# Altium schematic sheet PCB方案验证板  12V5A 60Wascii.SchDoc
size A2; SheetNumber: 1; SheetTotal: 1; PageSetup: Record=PageOptions|CenterHorizontal=True|CenterVertical=True|PrintScale=0.97|XCorrection=1.00|YCorrection=1.00|PrintKind=2|BorderSize=5000000|LeftOffset=0|BottomOffset=0|Orientation=2|PaperLength=1000|PaperWidth=1000|Scale=100|PaperSource=7|PrintQuality=-3|MediaType=1|DitherType=10|PrintScaleMode=1|PaperKind=A4|PaperIndex=9
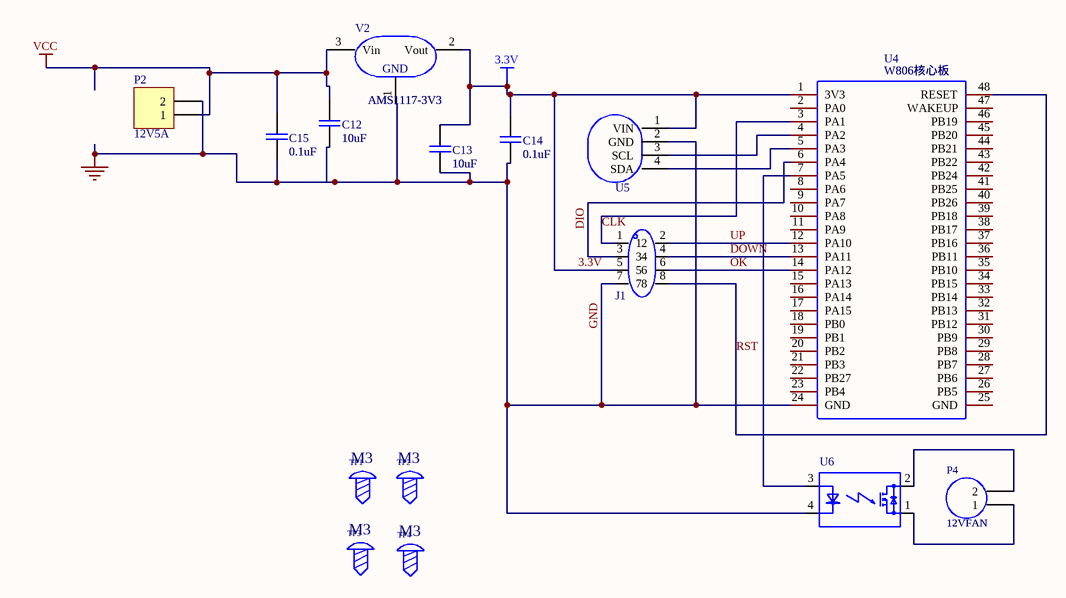
[diagram p0: PCB方案验证板  12V5A 60Wascii.SchDoc]

## Parts
C12  10uF  [0805-C]
C13  10uF  [0805-C]
C14  0.1uF  [0805-C]
C15  0.1uF  [0805-C]
J1  (no value)  [HDR-TH_8P-P2.54-V-F-R2-C4-S2.54-1]
P2  12V5A  [OUT]
P4  12VFAN  [OUT]
TP1  (no value)  [M3x8+6_N]
TP2  (no value)  [M3x8+6_N]
TP3  (no value)  [M3x8+6_N]
TP4  (no value)  [M3x8+6_N]
U4  W806核心板  [w806]
U5  (no value)  [AHT10]
U6  (no value)  [RELAY-TH_4P-L43.5-W10.3-PMN]
V2  AMS1117-3V3  [PG-SOT223-4_L6.5-W3.5-P2.30-LS7.0-BR]

## Nets
3.3V: C13.2 C14.2 J1.5 U4.1(3V3) U5.1(VIN) V2.2(Vout)
GND: C12.1 C13.1 C14.1 C15.1 J1.7 P2.GND(2) U4.24(GND) U5.2(GND) U6.4(+) V2.1(GND)
VCC: C12.2 C15.2 P2.VCC(1) V2.3(Vin)
CLK: J1.1 U4.3(PA1)
DIO: J1.3 U4.6(PA4)
DOWN: J1.4 U4.13(PA11)
OK: J1.6 U4.14(PA12)
RST: J1.8 U4.48(RESET)
UP: J1.2 U4.12(PA10)
NetP4_GND: P4.GND(2) U6.2(A)
NetP4_VCC: P4.VCC(1) U6.1(K)
NetU4_4: U4.4(PA2) U5.3(SCL)
NetU4_5: U4.5(PA3) U5.4(SDA)
NetU4_7: U4.7(PA5) U6.3(-)

Not connected (* = marked no-connect by the designer): U4 2(PA0) 8(PA6) 9(PA7) 10(PA8) 11(PA9) 15(PA13) 16(PA14) 17(PA15) 18(PB0) 19(PB1) 20(PB2) 21(PB3) 22(PB27) 23(PB4) 25(GND) 26(PB5) 27(PB6) 28(PB7) 29(PB8) 30(PB9) 31(PB12) 32(PB13) 33(PB14) 34(PB15) 35(PB10) 36(PB11) 37(PB16) 38(PB17) 39(PB18) 40(PB26) 41(PB25) 42(PB24) 43(PB22) 44(PB21) 45(PB20) 46(PB19) 47(WAKEUP)

## Library data of the parts
C12 C13 = CAP-SMT: Origin Footprint: C 0805_M; Add into BOM: yes; NAME: 2; Pin Type: IN; Symbol: CAP-SMT; Name: 10uF; Device: CAP-SMT; Convert to PCB: yes; NUMBER: 2
C14 C15 = CAP-SMT: Origin Footprint: C 0805_M; Add into BOM: yes; NAME: 2; Symbol: CAP-SMT; Name: 0.1uF; Device: CAP-SMT; Convert to PCB: yes; NUMBER: 2
J1 = 2.54mm,2×4Doublerowfemale: Manufacturer Part: 2.54mm,24Doublerowfemale; Add into BOM: yes; Symbol: 2.54MM,2×4DOUBLEROWFEMALE; Device: 2.54mm,2×4Doublerowfemale; LCSC Part Name: 2.54mm,24Doublerowfemale; Supplier Part: C9900004313; Supplier Footprint: HDR-TH_8P-P2.54-V-F-R2-C4-S2.54-1; JLCPCB Part Class: Extended Part; Supplier: LCSC; Convert to PCB: yes
P2 = Header 2: Header, 2-Pin; LatestRevisionDate: 17-Jul-2002; LatestRevisionNote: Re-released for DXP Platform.; Publisher: Altium Limited
P4 = 12V5A: Convert to PCB: yes; Symbol: 12V5A; Name: 12VFAN; Device: 12V5A; LatestRevisionDate: 17-Jul-2002; LatestRevisionNote: Re-released for DXP Platform.; Publisher: Altium Limited; Add into BOM: yes; Origin Footprint: OUT
TP1-TP4 = M3: Add into BOM: yes; Symbol: M3; Device: M3; Convert to PCB: yes
U4 = W806核心板: Convert to PCB: yes; Origin Footprint: W806最小系统板; Symbol: W806核心板; Name: W806核心板; Device: W806核心板; Add into BOM: yes
U5 = AHT10温湿度传感器: Convert to PCB: yes; Symbol: AHT10温湿度传感器; Device: AHT10温湿度传感器; Add into BOM: yes
U6 = PMN5D6132_ENMG: Manufacturer: PANASONIC(松下); Manufacturer Part: AQZ102D; Add into BOM: yes; Origin Footprint: PMN5A_ENMG; Symbol: PMN5D6132_ENMG; Device: PMN5D6132_ENMG; Convert to PCB: yes; Supplier: LCSC; Supplier Part: C76410; JLCPCB Part Class: Extended Part
V2 = AMS1117: BOM____: 稳压芯片; __Ȩ____: 源创客; Origin Footprint: SOT223_M; Add into BOM: yes; NAME: GND; Symbol: AMS1117; Name: AMS1117-3V3; Device: AMS1117; ѧϰ__Դ: www.ooocke.com; Convert to PCB: yes